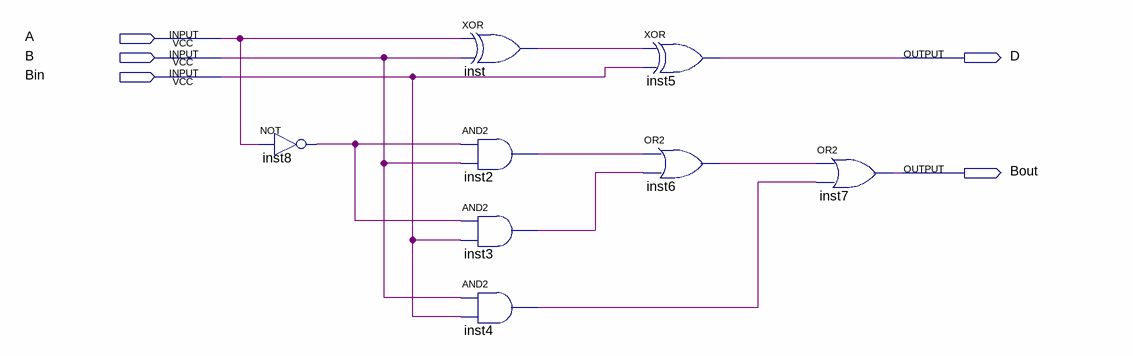
[diagram p0: schematic sheet]
// Quartus schematic projectfs.bdf as structural Verilog: 8 symbols, 5 pins
module projectfs (
  input  A,
  input  B,
  input  Bin,
  output D,
  output Bout
);

  wire inst2_out, inst3_out, inst4_out, inst6_out, inst8_out, inst_out;

  not inst8 (inst8_out, A);
  xor inst (inst_out, A, B);
  and inst2 (inst2_out, inst8_out, B);
  and inst3 (inst3_out, inst8_out, Bin);
  and inst4 (inst4_out, B, Bin);
  xor inst5 (D, inst_out, Bin);
  or inst6 (inst6_out, inst2_out, inst3_out);
  or inst7 (Bout, inst6_out, inst4_out);
endmodule
